# Altium schematic sheet SheetGUNVS.SchDoc
size A4; SheetNumber: 1; SheetTotal: 1
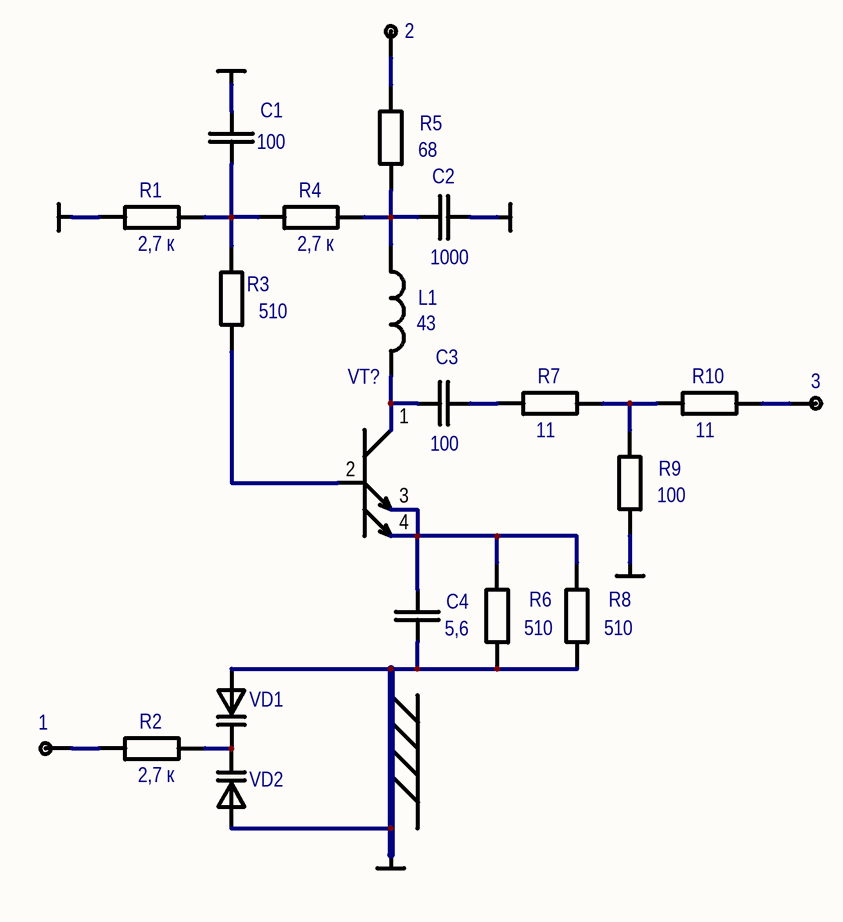
[diagram p0: SheetGUNVS.SchDoc]

## Parts
(Parts that share a designator on the sheet are numbered #1, #2 ... from top to bottom, then left to right.)
1  TP  [TP1]  (value not drawn)  (no BOM)
2  TP  [TP1]  (value not drawn)  (no BOM)
3  TP  [TP1]  (value not drawn)  (no BOM)
*?#1  GND  (value not drawn)  (graphical)
*?#2  GND  (value not drawn)  (graphical)
*?#3  GND  (value not drawn)  (graphical)
*?#4  GND  (value not drawn)  (graphical)
*?#5  GND  (value not drawn)  (graphical)
C1  100  [CAPC1005N]
C2  1000  [CAPC1005N]
C3  100  [CAPC1005L]
C4  5,6  [CAPC1005L]
L1  43  [INDC1608L]
R1  2,7 к  [RESC1005L]
R2  2,7 к  [RESC1005L]
R3  510  [RESC1005L]
R4  2,7 к  [RESC1005L]
R5  68  [RESC1005L]
R6  510  [RESC1005L]
R7  11  [RESC1005L]
R8  510  [RESC1005L]
R9  100  [RESC1005L]
R10  11  [RESC1005L]
VD1  BB149  [SOD2512X100N]  (value not drawn)
VD2  BB149  [SOD2512X100N]  (value not drawn)
VT?  (no value)  [SOT143B]

## Nets
GND: C1.2 C2.2 C4.1 R1.2 R6.2 R8.2 R9.2 VD1.2(Anode) VD2.2(Anode)
Net1_1: 1.1 R2.2
Net2_1: 2.1 R5.1
Net3_1: 3.1 R10.1
NetC1_1: C1.1 R1.1 R3.1 R4.2
NetC2_1: C2.1 L1.1 R4.1 R5.2
NetC3_1: C3.1 R7.2
NetC3_2: C3.2 L1.2 VT?.1(Collector)
NetC4_2: C4.2 R6.1 R8.1 VT?.3(Emitter) VT?.4(Emitter)
NetR2_1: R2.1 VD1.1(Cathode) VD2.1(Cathode)
NetR3_2: R3.2 VT?.2(Base)
NetR7_1: R7.1 R9.1 R10.2

## Library data of the parts
1-3 = TP: Test point
*?#1-*?#5 = GND: Корпус ЕСКД. Для "наложения" на штатный Power Bar
C1-C4 = C0402: Чип-конденсатор; Name: 0402; Power/Voltage: {Voltage}; TKE/TKC: {TKE/TKC}; Tolerance: {Tolerance}; Value: {Value}; BCPId: *; Manufacturer: *; ManufacturerPartNumber: *; Type: Конденсатор
L1 = L0603: Индуктивность без магнитопровода; Name: 0603; Tolerance: {Tolerance}; BCPId: *; Manufacturer: *; Package: *; ManufacturerPartNumber: *; Type: Индуктивность; Value: 43
R1-R10 = R0402: Чип-резистор; Name: 0402; Tolerance: {Tolerance}; Value: {Value}; BCPId: *; Manufacturer: *; ManufacturerPartNumber: *; Type: Резистор
VD1 VD2 = BB149: UHF variable capacitance diode; Manufacturer: NXP; ManufacturerPartNumber: BB149A; Type: Диод; SymAuthor: Юдин Д.Г.; BCPId: *; Name: *; Package: SC-76 (SOD323)
VT? = BFG67: Кремниевый биполярный 8 ГГц широкополосный n-p-n транзистор.; Manufacturer: NXP; BCPId: *; ManufacturerPartNumber: BFG67; Type: Транзистор; Package: SOT143B